# EAGLE schematic fountain_v17 (EAGLE 9.6.2)

## Sheet 1 of 2
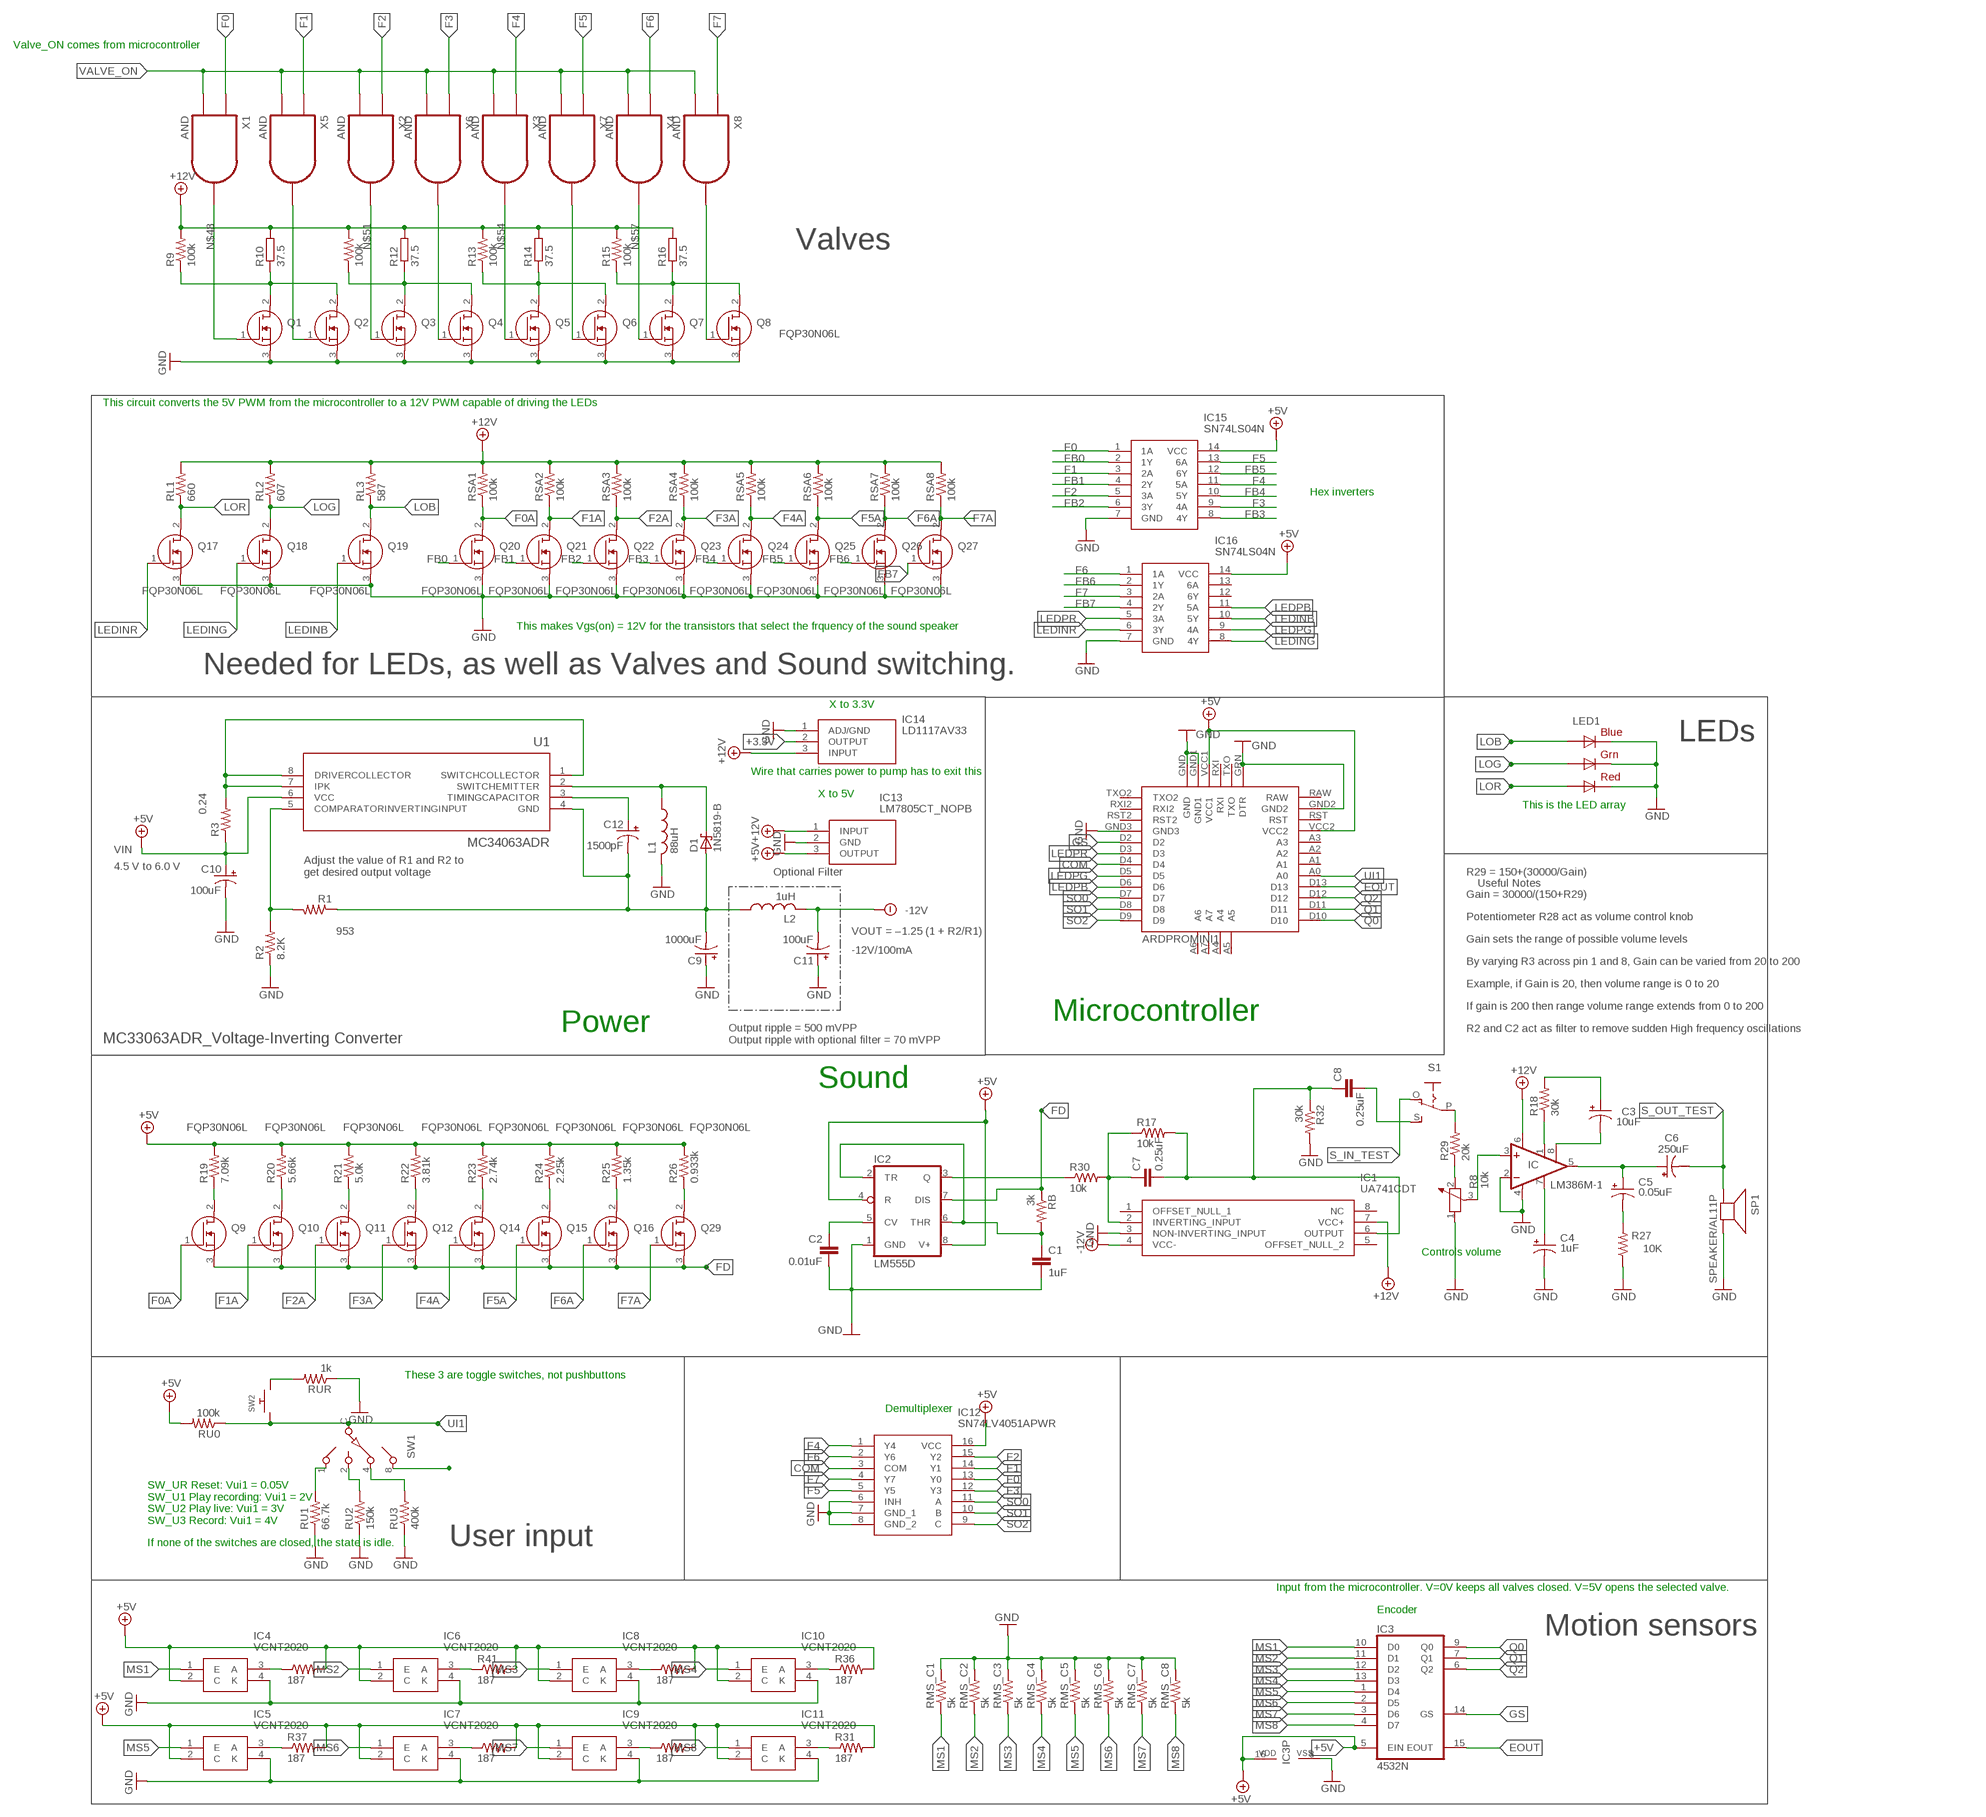
[diagram p0: schematic, sheet 1]

### Parts
ARDPROMINI1  ARDUINOPROMINI  [ARDUINOPROMINI]
C1  1uF  C-EUC0805  [C0805]
C2  0.01uF  C-EUC0805  [C0805]
C3  10uF  CPOL-US085CS-1AR  [085CS_1AR]
C4  1uF  CPOL-US085CS-1AR  [085CS_1AR]
C5  0.05uF  CPOL-US085CS-1AR  [085CS_1AR]
C6  250uF  CPOL-US085CS-1AR  [085CS_1AR]
C7  0.25uF  C-EUC0805  [C0805]
C8  0.25uF  C-EUC0805  [C0805]
C9  1000uF  CPOL-USE7.5-16  [E7,5-16]
C10  100uF  CPOL-USE2,5-6E  [E2,5-6E]
C11  100uF  CPOL-USE2,5-6E  [E2,5-6E]
C12  1500pF  CPOL-USE2,5-6E  [E2,5-6E]
D1  1N5819-B  [DO41-7.6]
IC  LM386M-1  [SO08]
IC1  UA741CDT  [SOIC127P600X175-8N]
IC2  LM555D  [SO08]
IC3  4532N  [DIL16]
IC4  VCNT2020  [VCNT2020]
IC5  VCNT2020  [VCNT2020]
IC6  VCNT2020  [VCNT2020]
IC7  VCNT2020  [VCNT2020]
IC8  VCNT2020  [VCNT2020]
IC9  VCNT2020  [VCNT2020]
IC10  VCNT2020  [VCNT2020]
IC11  VCNT2020  [VCNT2020]
IC12  SN74LV4051APWR  [SOP65P640X120-16N]
IC13  LM7805CT_NOPB  [TO254P470X1028X1955-3P]
IC14  LD1117AV33  [TO255P460X1020X2008-3P]
IC15  SN74LS04N  [DIP794W53P254L1930H508Q14N]
IC16  SN74LS04N  [DIP794W53P254L1930H508Q14N]
L1  88uH  L-USL3216C  [L3216C]
L2  1uH  L-USL3216C  [L3216C]
LED1  RGBLED5050  [RGBLED5050]
Q1  FQP30N06L  [TO254P470X1016X2019-3P]
Q2  FQP30N06L  [TO254P470X1016X2019-3P]
Q3  FQP30N06L  [TO254P470X1016X2019-3P]
Q4  FQP30N06L  [TO254P470X1016X2019-3P]
Q5  FQP30N06L  [TO254P470X1016X2019-3P]
Q6  FQP30N06L  [TO254P470X1016X2019-3P]
Q7  FQP30N06L  [TO254P470X1016X2019-3P]
Q8  FQP30N06L  [TO254P470X1016X2019-3P]
Q9  FQP30N06L  [TO254P470X1016X2019-3P]
Q10  FQP30N06L  [TO254P470X1016X2019-3P]
Q11  FQP30N06L  [TO254P470X1016X2019-3P]
Q12  FQP30N06L  [TO254P470X1016X2019-3P]
Q14  FQP30N06L  [TO254P470X1016X2019-3P]
Q15  FQP30N06L  [TO254P470X1016X2019-3P]
Q16  FQP30N06L  [TO254P470X1016X2019-3P]
Q17  FQP30N06L  [TO254P470X1016X2019-3P]
Q18  FQP30N06L  [TO254P470X1016X2019-3P]
Q19  FQP30N06L  [TO254P470X1016X2019-3P]
Q20  FQP30N06L  [TO254P470X1016X2019-3P]
Q21  FQP30N06L  [TO254P470X1016X2019-3P]
Q22  FQP30N06L  [TO254P470X1016X2019-3P]
Q23  FQP30N06L  [TO254P470X1016X2019-3P]
Q24  FQP30N06L  [TO254P470X1016X2019-3P]
Q25  FQP30N06L  [TO254P470X1016X2019-3P]
Q26  FQP30N06L  [TO254P470X1016X2019-3P]
Q27  FQP30N06L  [TO254P470X1016X2019-3P]
Q29  FQP30N06L  [TO254P470X1016X2019-3P]
R1  953  R-US_M0805  [M0805]
R2  8.2K  R-US_M0805  [M0805]
R3  0.24  R-US_M0805  [M0805]
R8  10k  POTENTIOMETER_PT-10  [PT-10]
R9  100k  R-US_R0805  [R0805]
R10  37.5  R-EU_0204/7  [0204/7]
R11  100k  R-US_R0805  [R0805]
R12  37.5  R-EU_0204/7  [0204/7]
R13  100k  R-US_R0805  [R0805]
R14  37.5  R-EU_0204/7  [0204/7]
R15  100k  R-US_R0805  [R0805]
R16  37.5  R-EU_0204/7  [0204/7]
R17  10k  R-US_R0805  [R0805]
R18  30k  R-US_R0805  [R0805]
R19  7.09k  R-US_R0805  [R0805]
R20  5.66k  R-US_R0805  [R0805]
R21  5.0k  R-US_R0805  [R0805]
R22  3.81k  R-US_R0805  [R0805]
R23  2.74k  R-US_R0805  [R0805]
R24  2.25k  R-US_R0805  [R0805]
R25  1.35k  R-US_R0805  [R0805]
R26  0.933k  R-US_R0805  [R0805]
R27  10K  R-US_M0805  [M0805]
R29  20k  R-US_R0805  [R0805]
R30  10k  R-US_R0805  [R0805]
R31  187  R-US_R0805  [R0805]
R32  30k  R-US_R0805  [R0805]
R34  187  R-US_R0805  [R0805]
R36  187  R-US_R0805  [R0805]
R37  187  R-US_R0805  [R0805]
R40  187  R-US_R0805  [R0805]
R41  187  R-US_R0805  [R0805]
R42  187  R-US_R0805  [R0805]
R44  187  R-US_R0805  [R0805]
RB  3k  R-US_R0805  [R0805]
RL1  660  R-US_R0805  [R0805]
RL2  607  R-US_R0805  [R0805]
RL3  587  R-US_R0805  [R0805]
RMS_C1  5k  R-US_R0805  [R0805]
RMS_C2  5k  R-US_R0805  [R0805]
RMS_C3  5k  R-US_R0805  [R0805]
RMS_C4  5k  R-US_R0805  [R0805]
RMS_C5  5k  R-US_R0805  [R0805]
RMS_C6  5k  R-US_R0805  [R0805]
RMS_C7  5k  R-US_R0805  [R0805]
RMS_C8  5k  R-US_R0805  [R0805]
RSA1  100k  R-US_R0805  [R0805]
RSA2  100k  R-US_R0805  [R0805]
RSA3  100k  R-US_R0805  [R0805]
RSA4  100k  R-US_R0805  [R0805]
RSA5  100k  R-US_R0805  [R0805]
RSA6  100k  R-US_R0805  [R0805]
RSA7  100k  R-US_R0805  [R0805]
RSA8  100k  R-US_R0805  [R0805]
RU0  100k  R-US_R0805  [R0805]
RU1  66.7k  R-US_R0805  [R0805]
RU2  150k  R-US_R0805  [R0805]
RU3  400k  R-US_R0805  [R0805]
RUR  1k  R-US_R0805  [R0805]
S1  EG1218S  [EG1218]
SP1  SPEAKER/AL11P  [AL11P]
SW1  SW-C10  [SW-C10]
SW2  SWITCH_PUSHBUTTONC&K_KSS  [BTN_CK_KSS]
U1  MC34063ADR  [D8]
X1  AND  (no package)
X2  AND  (no package)
X3  AND  (no package)
X4  AND  (no package)
X5  AND  (no package)
X6  AND  (no package)
X7  AND  (no package)
X8  AND  (no package)

### Nets
+3.3V: IC14.2(OUTPUT)
+5V: ARDPROMINI1.VCC1 ARDPROMINI1.VCC2 C10.+ IC2.4(R) IC2.8(V+) IC3.5(EIN) IC3.16(VDD) IC4.2(C) IC5.2(C) IC6.2(C) IC7.2(C) IC8.2(C) IC9.2(C) IC10.2(C) IC11.2(C) IC12.16(VCC) IC13.3(OUTPUT) IC15.14(VCC) IC16.14(VCC) R3.1 R19.2 R20.2 R21.2 R22.2 R23.2 R24.2 R25.2 R26.2 R31.2 R34.2 R36.2 R37.2 R40.2 R41.2 R42.2 R44.2 RU0.2 U1.6(VCC)
+12V: IC1.7(VCC+) IC13.1(INPUT) IC14.3(INPUT) IC.6(VS) R9.2 R10.2 R11.2 R12.2 R13.2 R14.2 R15.2 R16.2 RL1.2 RL2.2 RL3.2 RSA1.2 RSA2.2 RSA3.2 RSA4.2 RSA5.2 RSA6.2 RSA7.2 RSA8.2
-12V: C11.- IC1.4(VCC-) L2.2
COM: ARDPROMINI1.D4 IC12.3(COM)
EOUT: ARDPROMINI1.D13 IC3.15(EOUT)
F0: IC12.13(Y0) IC15.1(1A) X1.A
F0A: Q9.1(G) Q20.2(D) RSA1.1
F1: IC12.14(Y1) IC15.3(2A) X5.A
F1A: Q10.1(G) Q21.2(D) RSA2.1
F2: IC12.15(Y2) IC15.5(3A) X2.A
F2A: Q11.1(G) Q22.2(D) RSA3.1
F3: IC12.12(Y3) IC15.9(4A) X6.A
F3A: Q12.1(G) Q23.2(D) RSA4.1
F4: IC12.1(Y4) IC15.11(5A) X3.A
F4A: Q14.1(G) Q24.2(D) RSA5.1
F5: IC12.5(Y5) IC15.13(6A) X7.A
F5A: Q15.1(G) Q25.2(D) RSA6.1
F6: IC12.2(Y6) IC16.1(1A) X4.A
F6A: Q16.1(G) Q26.2(D) RSA7.1
F7: IC12.4(Y7) IC16.3(2A) X8.A
F7A: Q27.2(D) Q29.1(G) RSA8.1
FB0: IC15.2(1Y) Q20.1(G)
FB1: IC15.4(2Y) Q21.1(G)
FB2: IC15.6(3Y) Q22.1(G)
FB3: IC15.8(4Y) Q23.1(G)
FB4: IC15.10(5Y) Q24.1(G)
FB5: IC15.12(6Y) Q25.1(G)
FB6: IC16.2(1Y) Q26.1(G)
FB7: IC16.4(2Y) Q27.1(G)
FD: IC2.7(DIS) Q9.3(S) Q10.3(S) Q11.3(S) Q12.3(S) Q14.3(S) Q15.3(S) Q16.3(S) Q29.3(S) RB.1
GND: ARDPROMINI1.GND ARDPROMINI1.GND1 ARDPROMINI1.GND2 ARDPROMINI1.GND3 ARDPROMINI1.GRN(DTR) C1.2 C2.2 C4.- C9.+ C10.- C11.+ IC1.3(NON-INVERTING_INPUT) IC2.1(GND) IC3.8(VSS) IC4.4(K) IC5.4(K) IC6.4(K) IC7.4(K) IC8.4(K) IC9.4(K) IC10.4(K) IC11.4(K) IC12.6(INH) IC12.7(GND_1) IC12.8(GND_2) IC13.2(GND) IC14.1(ADJ/GND) IC15.7(GND) IC16.7(GND) IC.2(-IN) IC.4(GND) L1.2 LED1.4(BLUE_C) LED1.5(RED_C) LED1.6(GREEN_C) Q1.3(S) Q2.3(S) Q3.3(S) Q4.3(S) Q5.3(S) Q6.3(S) Q7.3(S) Q8.3(S) Q17.3(S) Q18.3(S) Q19.3(S) Q20.3(S) Q21.3(S) Q22.3(S) Q23.3(S) Q24.3(S) Q25.3(S) Q26.3(S) Q27.3(S) R2.1 R8.1 R27.1 R32.2 RMS_C1.2 RMS_C2.2 RMS_C3.2 RMS_C4.2 RMS_C5.2 RMS_C6.2 RMS_C7.2 RMS_C8.2 RU1.1 RU2.1 RU3.1 RUR.1 SP1.-
GS: ARDPROMINI1.D2 IC3.14(GS)
LEDINB: IC16.10(5Y) Q19.1(G)
LEDING: IC16.8(4Y) Q18.1(G)
LEDINR: IC16.6(3Y) Q17.1(G)
LEDPB: ARDPROMINI1.D6 IC16.11(5A)
LEDPG: ARDPROMINI1.D5 IC16.9(4A)
LEDPR: ARDPROMINI1.D3 IC16.5(3A)
LOB: LED1.3(BLUE_A) Q19.2(D) RL3.1
LOG: LED1.1(GREEN_A) Q18.2(D) RL2.1
LOR: LED1.2(RED_A) Q17.2(D) RL1.1
MS1: IC3.10(D0) IC4.1(E) RMS_C1.1
MS2: IC3.11(D1) IC6.1(E) RMS_C2.1
MS3: IC3.12(D2) IC8.1(E) RMS_C3.1
MS4: IC3.13(D3) IC10.1(E) RMS_C4.1
MS5: IC3.1(D4) IC5.1(E) RMS_C5.1
MS6: IC3.2(D5) IC7.1(E) RMS_C6.1
MS7: IC3.3(D6) IC9.1(E) RMS_C7.1
MS8: IC3.4(D7) IC11.1(E) RMS_C8.1
N$1: Q1.2(D) Q2.2(D) R9.1 R10.1
N$2: RU3.2 SW1.4
N$3: Q3.2(D) Q4.2(D) R11.1 R12.1
N$4: R3.2 U1.1(SWITCHCOLLECTOR) U1.7(IPK) U1.8(DRIVERCOLLECTOR)
N$5: Q5.2(D) Q6.2(D) R13.1 R14.1
N$6: D1.C L1.1 U1.2(SWITCHEMITTER)
N$7: Q7.2(D) Q8.2(D) R15.1 R16.1
N$8: C12.+ U1.3(TIMINGCAPACITOR)
N$9: C2.1 IC2.5(CV)
N$10: IC4.3(A) R44.1
N$11: C1.1 IC2.2(TR) IC2.6(THR) RB.2
N$12: Q9.2(D) R19.1
N$13: Q10.2(D) R20.1
N$14: Q11.2(D) R21.1
N$15: Q12.2(D) R22.1
N$16: Q14.2(D) R23.1
N$17: Q15.2(D) R24.1
N$18: Q16.2(D) R25.1
N$19: Q29.2(D) R26.1
N$20: C4.+ IC.7(BYPASS)
N$21: C5.+ C6.+ IC.5(OUT)
N$22: C3.- IC.8(GAIN)
N$23: IC.3(+IN) R8.3
N$24: C5.- R27.2
N$25: IC.1(GAIN) R18.1
N$26: C3.+ R18.2
N$27: R29.2 S1.P
N$28: C7.1 IC1.2(INVERTING_INPUT) R17.1 R30.2
N$29: C7.2 C8.1 IC1.6(OUTPUT) R17.2 R32.1
N$30: RUR.2 SW2.P$2
N$31: IC5.3(A) R37.1
N$32: IC6.3(A) R41.1
N$34: RU2.2 SW1.2
N$35: RU1.2 SW1.1
N$36: IC8.3(A) R42.1
N$37: IC10.3(A) R36.1
N$38: R1.2 R2.2 U1.5(COMPARATORINVERTINGINPUT)
N$39: IC11.3(A) R31.1
N$40: IC9.3(A) R40.1
N$41: IC7.3(A) R34.1
N$42: C9.- C12.- D1.A L2.1 R1.1 U1.4(GND)
N$43: R8.2 R29.1
N$44: C8.2 S1.S
N$45: IC2.3(Q) R30.1
N$46: SW1.8
N$47: Q2.1(G) X5.Y
N$48: Q1.1(G) X1.Y
N$50: Q4.1(G) X6.Y
N$51: Q3.1(G) X2.Y
N$53: Q6.1(G) X7.Y
N$54: Q5.1(G) X3.Y
N$56: Q8.1(G) X8.Y
N$57: Q7.1(G) X4.Y
Q0: ARDPROMINI1.D10 IC3.9(Q0)
Q1: ARDPROMINI1.D11 IC3.7(Q1)
Q2: ARDPROMINI1.D12 IC3.6(Q2)
S_IN_TEST: S1.O
S_OUT_TEST: C6.- SP1.+
SO0: ARDPROMINI1.D7 IC12.11(A)
SO1: ARDPROMINI1.D8 IC12.10(B)
SO2: ARDPROMINI1.D9 IC12.9(C)
UI1: ARDPROMINI1.A0 RU0.1 SW1.C SW2.P$1
VALVE_ON: X1.B X2.B X3.B X4.B X5.B X6.B X7.B X8.B
Unconnected: ARDPROMINI1.A1 ARDPROMINI1.A2 ARDPROMINI1.A3 ARDPROMINI1.A4 ARDPROMINI1.A5 ARDPROMINI1.A6 ARDPROMINI1.A7 ARDPROMINI1.RAW ARDPROMINI1.RST ARDPROMINI1.RST2 ARDPROMINI1.RXI ARDPROMINI1.RXI2 ARDPROMINI1.TXO ARDPROMINI1.TXO2 IC1.1(OFFSET_NULL_1) IC1.5(OFFSET_NULL_2) IC1.8(NC) IC16.12(6Y) IC16.13(6A)

### Notes on the sheet
- Valve_ON comes from microcontroller
- Valves
- This circuit converts the 5V PWM from the microcontroller to a 12V PWM capable of driving the LEDs
- Hex inverters
- This makes Vgs(on) = 12V for the transistors that select the frquency of the sound speaker
- Needed for LEDs, as well as Valves and Sound switching.
- X to 3.3V
- LEDs
- Wire that carries power to pump has to exit this
- X to 5V
- This is the LED array
- VIN
- 4.5 V to 6.0 V
- Adjust the value of R1 and R2 to
  get desired output voltage
- Optional Filter | R29 = 150+(30000/Gain)
- Useful Notes
- Gain = 30000/(150+R29)
- Potentiometer R28 act as volume control knob
- VOUT = –1.25 (1 + R2/R1)
- Gain sets the range of possible volume levels
- -12V/100mA
- By varying R3 across pin 1 and 8, Gain can be varied from 20 to 200
- Example, if Gain is 20, then volume range is 0 to 20
- If gain is 200 then range volume range extends from 0 to 200
- Microcontroller
- Power | R2 and C2 act as filter to remove sudden High frequency oscillations
- MC33063ADR_Voltage-Inverting Converter
- Output ripple = 500 mVPP
  Output ripple with optional filter = 70 mVPP
- Sound
- Controls volume
- These 3 are toggle switches, not pushbuttons
- Demultiplexer
- SW_UR Reset: Vui1 = 0.05V
  SW_U1 Play recording: Vui1 = 2V
  SW_U2 Play live: Vui1 = 3V
  SW_U3 Record: Vui1 = 4V
- If none of the switches are closed, the state is idle. | User input
- Input from the microcontroller. V=0V keeps all valves closed. V=5V opens the selected valve.
- Encoder
- Motion sensors

## Sheet 2 of 2

## Library data of the parts
ARDPROMINI1 = ARDPROMINI:ARDUINOPROMINI
C1 C2 = rcl:C-EU: CAPACITOR, European symbol
C3-C6 = resistor:CPOL-US: POLARIZED CAPACITOR, American symbol; SPICEPREFIX: C
C7 C8 = rcl:C-EU: CAPACITOR, European symbol; SPICEPREFIX: C
C9-C12 = rcl:CPOL-US: POLARIZED CAPACITOR, American symbol
D1 = diode:1N581*: 1.0A SCHOTTKY BARRIER RECTIFIER Source: http://www.diodes.com/datasheets/ds23001.pdf
IC = linear:LM386?-*: Low Voltage Audio Power Amplifier Source: http://cache.national.com/ds/LM/LM386.pdf; SPICEPREFIX: X
IC1 = SamacSys_Parts:UA741CDT: UA741CDT, Operational Amplifier 1MHz, 8-Pin SO Source: Datasheet <http://www.st.com/st-web-ui/static/active/en/resource/technical/document/datasheet/CD00001252.pdf>; DESCRIPTION: UA741CDT, Operational Amplifier 1MHz, 8-Pin SO; HEIGHT: 1.75mm; MANUFACTURER_NAME: STMicroelectronics; MANUFACTURER_PART_NUMBER: UA741CDT; MOUSER_PART_NUMBER: 511-UA741CDT; MOUSER_PRICE-STOCK: https://www.mouser.co.uk/ProductDetail/STMicroelectronics/UA741CDT?qs=%2FlukYmqnbBNY05lTc81SqA%3D%3D; SPICEPREFIX: X
IC2 = linear:*555: TIMER; SPICEPREFIX: X
IC3 = 45xx:4532: 8-bit PRIORITY ENCODER; SPICEPREFIX: X
IC4-IC11 = SamacSys_Parts:VCNT2020: Optical Switches, Reflective, Phototransistor Output Ref Optical Sensor Transtr Output 940nm Source: Datasheet <https://www.vishay.com/docs/84285/vcnt2020.pdf>; DESCRIPTION: Optical Switches, Reflective, Phototransistor Output Ref Optical Sensor Transtr Output 940nm; HEIGHT: 0mm; MANUFACTURER_NAME: Vishay; MANUFACTURER_PART_NUMBER: VCNT2020; MOUSER_PART_NUMBER: 78-VCNT2020; MOUSER_PRICE-STOCK: https://www.mouser.co.uk/ProductDetail/Vishay-Semiconductors/VCNT2020?qs=A6JNR%252BY%2FHHeERL3sVKpQTg%3D%3D
IC12 = SamacSys_Parts:SN74LV4051APWR: 8-Channel Analog Multiplexer/Demultiplexer Source: Datasheet <http://www.ti.com/lit/gpn/sn74lv4051a>; DESCRIPTION: 8-Channel Analog Multiplexer/Demultiplexer; HEIGHT: 1.2mm; MANUFACTURER_NAME: Texas Instruments; MANUFACTURER_PART_NUMBER: SN74LV4051APWR; MOUSER_PART_NUMBER: 595-SN74LV4051APWR; MOUSER_PRICE-STOCK: https://www.mouser.co.uk/ProductDetail/Texas-Instruments/SN74LV4051APWR?qs=j%2FZo4ajzVJI89x2tgWsgsA%3D%3D; SPICEPREFIX: X
IC13 = SamacSys_Parts:LM7805CT_NOPB: 1.5-A, Wide VIN Fixed Voltage Regulators Source: Datasheet <http://www.ti.com/lit/gpn/lm7800>; DESCRIPTION: 1.5-A, Wide VIN Fixed Voltage Regulators; HEIGHT: 4.7mm; MANUFACTURER_NAME: Texas Instruments; MANUFACTURER_PART_NUMBER: LM7805CT/NOPB; MOUSER_PART_NUMBER: 926-LM7805CT/NOPB; MOUSER_PRICE-STOCK: https://www.mouser.co.uk/ProductDetail/Texas-Instruments/LM7805CT-NOPB?qs=OYMYEaN9QmBS2GvaX6GSkQ%3D%3D
IC14 = SamacSys_Parts:LD1117AV33: LD1117AV33, Low Dropout Voltage Regulator, 1.2A, 3.3 V +/-2%, 3-Pin TO-220 Source: Datasheet <http://www.st.com/web/en/resource/technical/document/datasheet/CD00002116.pdf>; DESCRIPTION: LD1117AV33, Low Dropout Voltage Regulator, 1.2A, 3.3 V +/-2%, 3-Pin TO-220; HEIGHT: 4.6mm; MANUFACTURER_NAME: STMicroelectronics; MANUFACTURER_PART_NUMBER: LD1117AV33; MOUSER_PART_NUMBER: 511-LD1117AV33; MOUSER_PRICE-STOCK: https://www.mouser.co.uk/ProductDetail/STMicroelectronics/LD1117AV33?qs=hUhhBvpTJN9Rfx8G8TXH1A%3D%3D
IC15 IC16 = SamacSys_Parts:SN74LS04N: Hex inverter,SN74LS04N DIP14 25pcs Source: Datasheet <http://www.ti.com/lit/gpn/sn74ls04>; DESCRIPTION: Hex inverter,SN74LS04N DIP14 25pcs; HEIGHT: 5.08mm; MANUFACTURER_NAME: Texas Instruments; MANUFACTURER_PART_NUMBER: SN74LS04N; MOUSER_PART_NUMBER: 595-SN74LS04N; MOUSER_PRICE-STOCK: https://www.mouser.co.uk/ProductDetail/Texas-Instruments/SN74LS04N?qs=spW5eSrOWB4DgGWIHPxzvg%3D%3D; SPICEPREFIX: X
L1 L2 = rcl:L-US: INDUCTOR, American symbol; SPICEPREFIX: L
LED1 = adafruit:RGBLED: For 5050 RGB LEDs, the order of the LEDs may vary from one manufacturer to another!
Q1-Q12 Q14-Q27 Q29 = SamacSys_Parts:FQP30N06L: FQP30N06L N-Channel MOSFET, 32 A, 60 V QFET, 3-Pin TO-220 ON Semiconductor Source: Datasheet; DESCRIPTION: FQP30N06L N-Channel MOSFET, 32 A, 60 V QFET, 3-Pin TO-220 ON Semiconductor; HEIGHT: 4.7mm; MANUFACTURER_NAME: ON Semiconductor; MANUFACTURER_PART_NUMBER: FQP30N06L; MOUSER_PART_NUMBER: 512-FQP30N06L; MOUSER_PRICE-STOCK: https://www.mouser.co.uk/ProductDetail/ON-Semiconductor-Fairchild/FQP30N06L?qs=%252Beu4QTTVkDqugBwFplJ%252Bug%3D%3D
R1-R3 R9 R11 R13 R15 R17-R26 R29-R32 R34 R36 R37 R40-R42 R44 RB RL1-RL3 RMS_C1-RMS_C8 RSA1-RSA8 RU0 RU1-RU3 RUR = rcl:R-US_: RESISTOR, American symbol; SPICEPREFIX: R
R8 = rcl:POTENTIOMETER_: Potentiometer; SPICEMODEL: POT; SPICEPREFIX: X
R10 R12 R14 R16 = rcl:R-EU_: RESISTOR, European symbol; SPICEPREFIX: R
R27 = resistor:R-US_: RESISTOR, American symbol; SPICEPREFIX: R
S1 = adafruit:EG1218: SLIDING SWITCH 0.1" spacing through hole, vertical SPDT slide switch http://www.ladyada.net/library/pcb/eaglelibrary.html; SPICEPREFIX: J
SP1 = adafruit:SPEAKER: SPEAKER Source: Buerklin Added PS12 (for part # PS1240 piezo) http://www.ladyada.net/library/pcb/eaglelibrary.html
SW1 = special:SW-C10: SWITCH 10-step rotary switch
SW2 = adafruit:SWITCH_PUSHBUTTON: Buttons SOFTTOUCHSMD_SJ - Soft touch temporary push button (Super Junk Akihabara) Compatible with SKPMANE010 [Mouser: 688-SKPMAN] C&K_KSS = Digikey: KSS221GLFS
U1 = MC34063ADR:MC34063ADR; MANUFACTURER_PART_NUMBER: MC34063ADR; VENDOR: Texas Instruments
X1-X8 = ngspice-digital:AND: 2 input logic AND gate

## Net classes
0 default: width 0.203 mm
1 vcc: width 0.254 mm